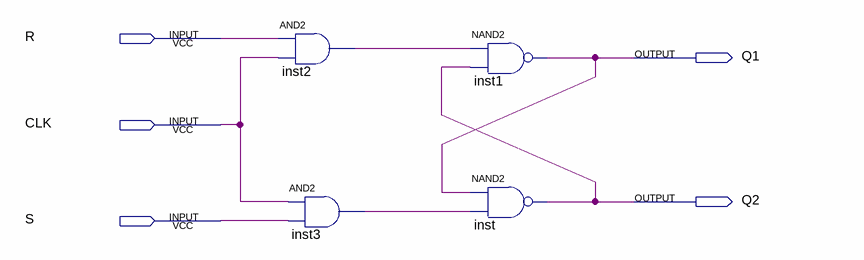
[diagram p0: schematic sheet]
// Quartus schematic latch_RS_nandEN.bdf as structural Verilog: 4 symbols, 5 pins
module latch_RS_nandEN (
  input  R,
  input  CLK,
  input  S,
  output Q1,
  output Q2
);

  wire inst2_out, inst3_out;

  and inst2 (inst2_out, R, CLK);
  and inst3 (inst3_out, CLK, S);
  nand inst1 (Q1, inst2_out, Q2);
  nand inst (Q2, Q1, inst3_out);
endmodule
